# Altium schematic sheet MainBoard_144_IOs.SchDoc
size B
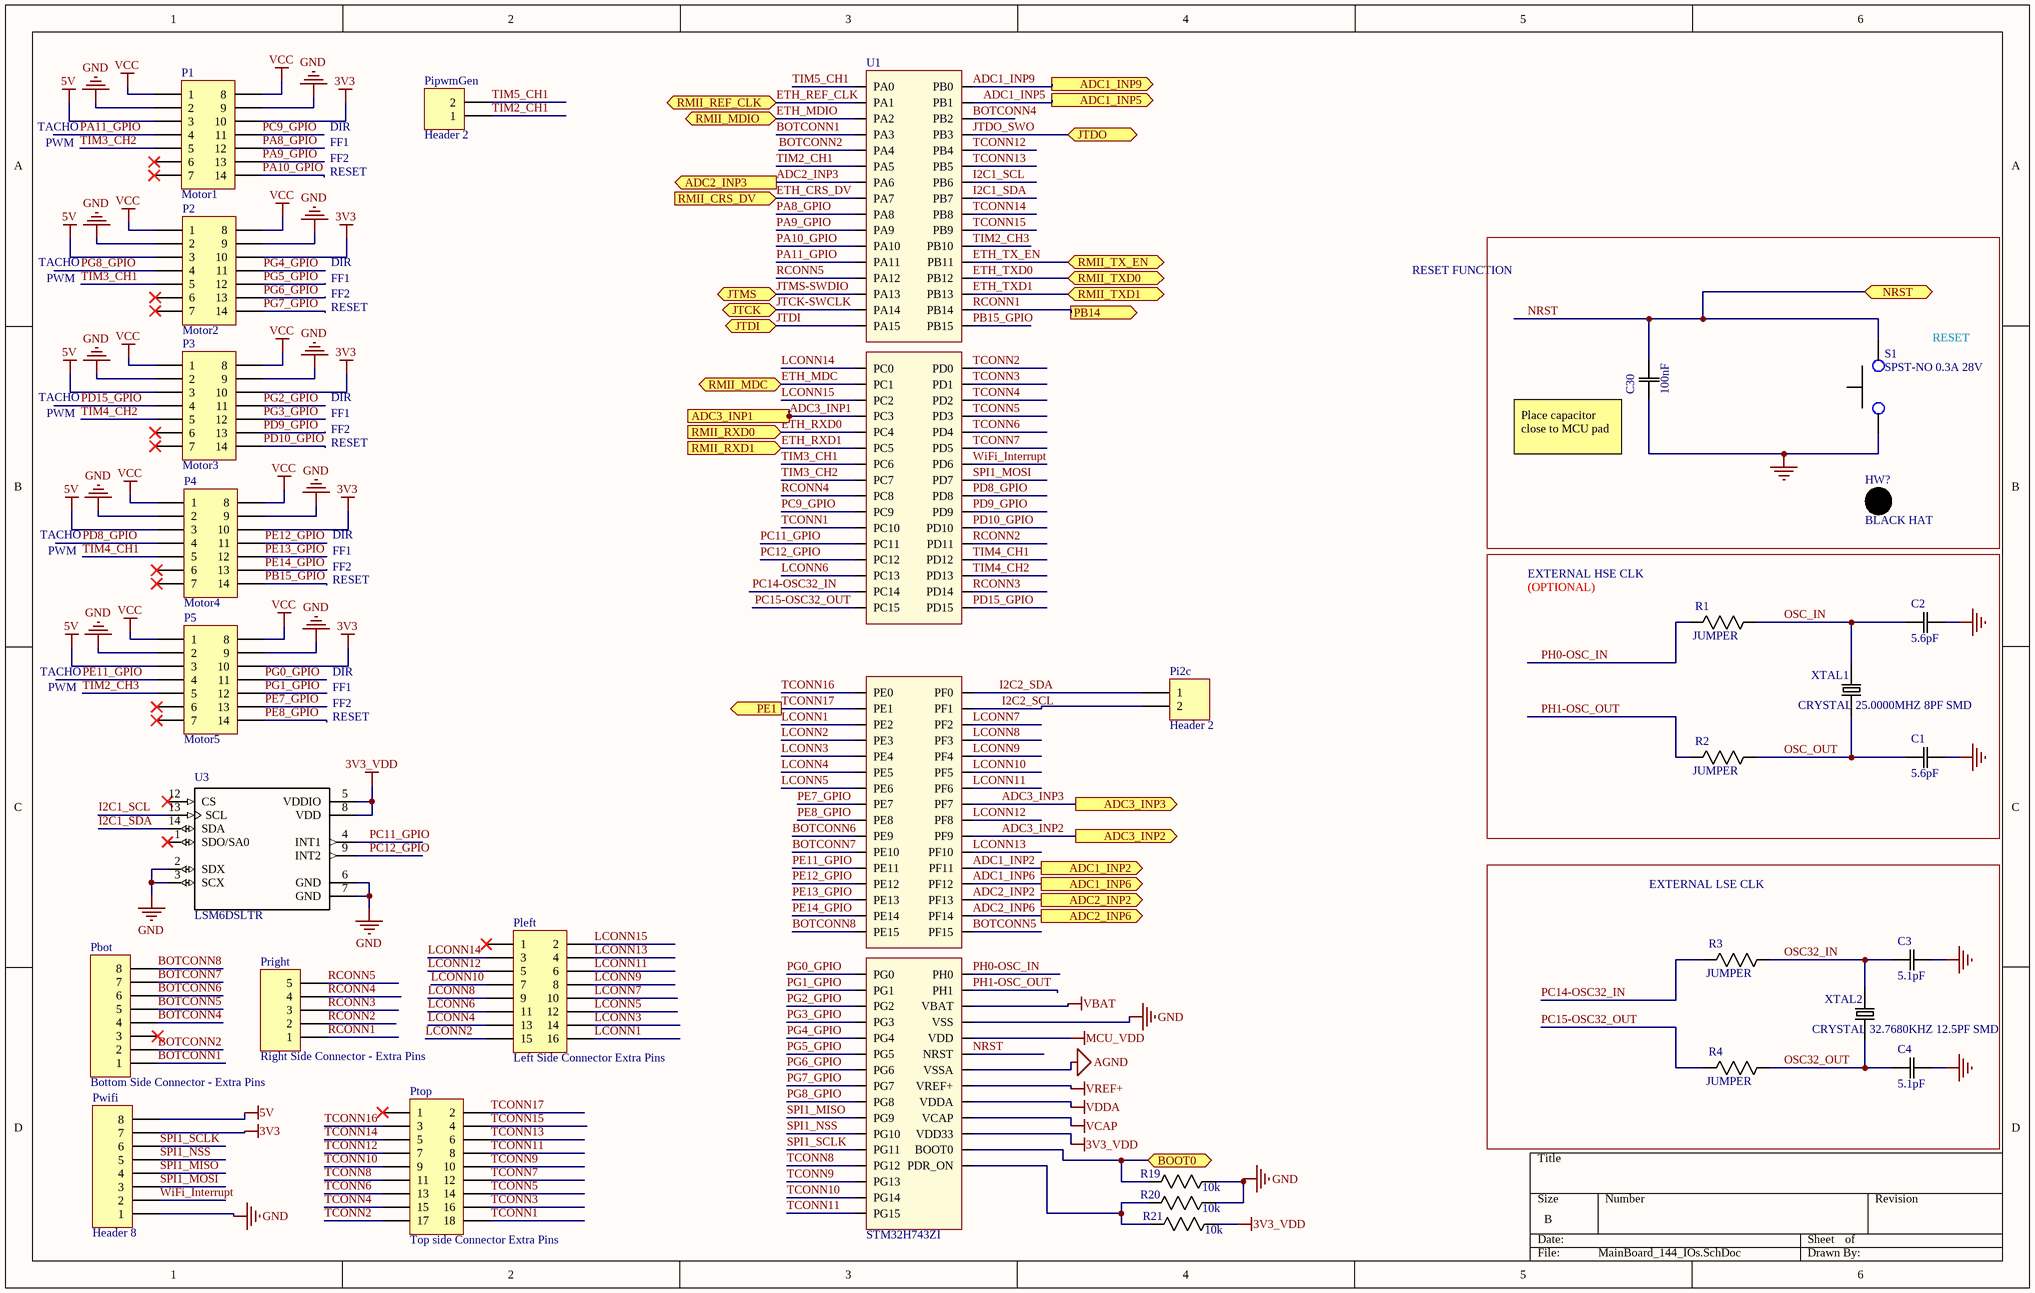
[diagram p0: MainBoard_144_IOs.SchDoc]

## Parts
C1  5.6pF  [0805]
C2  5.6pF  [0805]
C3  5.1pF  [0805]
C4  5.1pF  [0805]
C30  100nF  [0805]
HW?  value BLACK HAT  (hidden comment: BUTTON_HAT_BLACK)  (mechanical)
P1  Motor1  [HDR2X7_CEN]
P2  Motor2  [HDR2X7_CEN]
P3  Motor3  [HDR2X7_CEN]
P4  Motor4  [HDR2X7_CEN]
P5  Motor5  [HDR2X7_CEN]
Pbot  Bottom Side Connector - Extra Pins  [HDR1X8]
Pi2c  Header 2  [HDR1X2]
PipwmGen  Header 2  [HDR1X2]
Pleft  Left Side Connector Extra Pins  [HDR2X8]
Pright  Right Side Connector - Extra Pins  [HDR1X5]
Ptop  Top side Connector Extra Pins  [HDR2X9]
Pwifi  Header 8  [HDR1X8]
R1  JUMPER  [0805]
R2  JUMPER  [0805]
R3  JUMPER  [0805]
R4  JUMPER  [0805]
R19  10k  [0805]
R20  10k  [0805]
R21  10k  [0805]
S1  SPST-NO 0.3A 28V  [PB300STQ]
U1  STM32H743ZI  [STM32H7]
U3  LSM6DSLTR  [LGA-14]
XTAL1  CRYSTAL 25.0000MHZ 8PF SMD  [SMD-2]
XTAL2  CRYSTAL 32.7680KHZ 12.5PF SMD  [SMD-2]

## Blocks framed on the sheet
EXTERNAL LSE CLK: C3 C4 R3 R4 XTAL2

## Ports
ADC1_INP2 (out), ADC1_INP5 (out), ADC1_INP6 (out), ADC1_INP9 (out), ADC2_INP2 (out), ADC2_INP3 (out), ADC2_INP6 (out), ADC3_INP1 (out), ADC3_INP2 (out), ADC3_INP3 (out), BOOT0 (bidir), JTCK (bidir), JTDI (bidir), JTDO (bidir), JTMS (bidir), NRST (bidir), PB14 (out), PE1 (out), RMII_CRS_DV (in), RMII_MDC (bidir), RMII_MDIO (bidir), RMII_REF_CLK (bidir), RMII_RXD0 (in), RMII_RXD1 (in), RMII_TX_EN (bidir), RMII_TXD0 (bidir), RMII_TXD1 (bidir)

## Nets
3V3: P1.10 P2.10 P3.10 P4.10 P5.10 Pwifi.7
3V3_VDD: R21.1(R1) U1.VDD33USB(VDD33) U3.5(VDDIO) U3.8(VDD)
5V: P1.3 P2.3 P3.3 P4.3 P5.3 Pwifi.8
AGND: U1.VSSA
GND: C1.2(C2) C2.2(C2) C3.2(C2) C4.2(C2) C30.1(C1) P1.2 P1.9 P2.2 P2.9 P3.2 P3.9 P4.2 P4.9 P5.2 P5.9 Pwifi.1 R19.1(R1) R20.1(R1) S1.1 U1.VSS U3.2(SDX) U3.3(SCX) U3.6(GND) U3.7(GND)
MCU_VDD: U1.VDD
VBAT: U1.VBAT
VCAP: U1.VCAP
VCC: P1.1 P1.8 P2.1 P2.8 P3.1 P3.8 P4.1 P4.8 P5.1 P5.8
VDDA: U1.VDDA
VREF+: U1.VREF+
ADC1_INP2: U1.PF11 ; port ADC1_INP2
ADC1_INP5: U1.PB1 ; port ADC1_INP5
ADC1_INP6: U1.PF12 ; port ADC1_INP6
ADC1_INP9: U1.PB0 ; port ADC1_INP9
ADC2_INP2: U1.PF13 ; port ADC2_INP2
ADC2_INP3: U1.PA6 ; port ADC2_INP3
ADC2_INP6: U1.PF14 ; port ADC2_INP6
ADC3_INP1: U1.PC3 ; port ADC3_INP1
ADC3_INP2: U1.PF9 ; port ADC3_INP2
ADC3_INP3: U1.PF7 ; port ADC3_INP3
BOOT0: R19.2(R2) U1.BOOT0 ; port BOOT0
BOTCONN1: Pbot.1 U1.PA3
BOTCONN2: Pbot.2 U1.PA4
BOTCONN4: Pbot.4 U1.PB2
BOTCONN5: Pbot.5 U1.PF15
BOTCONN6: Pbot.6 U1.PE9
BOTCONN7: Pbot.7 U1.PE10
BOTCONN8: Pbot.8 U1.PE15
ETH_CRS_DV: U1.PA7 ; port RMII_CRS_DV
ETH_MDC: U1.PC1 ; port RMII_MDC
ETH_MDIO: U1.PA2 ; port RMII_MDIO
ETH_REF_CLK: U1.PA1 ; port RMII_REF_CLK
ETH_RXD0: U1.PC4 ; port RMII_RXD0
ETH_RXD1: U1.PC5 ; port RMII_RXD1
ETH_TX_EN: U1.PB11 ; port RMII_TX_EN
ETH_TXD0: U1.PB12 ; port RMII_TXD0
ETH_TXD1: U1.PB13 ; port RMII_TXD1
I2C1_SCL: U1.PB6 U3.13(SCL)
I2C1_SDA: U1.PB7 U3.14(SDA)
I2C2_SCL: Pi2c.2 U1.PF1
I2C2_SDA: Pi2c.1 U1.PF0
JTCK-SWCLK: U1.PA14 ; port JTCK
JTDI: U1.PA15 ; port JTDI
JTDO_SWO: U1.PB3 ; port JTDO
JTMS-SWDIO: U1.PA13 ; port JTMS
LCONN1: Pleft.16 U1.PE2
LCONN2: Pleft.15 U1.PE3
LCONN3: Pleft.14 U1.PE4
LCONN4: Pleft.13 U1.PE5
LCONN5: Pleft.12 U1.PE6
LCONN6: Pleft.11 U1.PC13
LCONN7: Pleft.10 U1.PF2
LCONN8: Pleft.9 U1.PF3
LCONN9: Pleft.8 U1.PF4
LCONN10: Pleft.7 U1.PF5
LCONN11: Pleft.6 U1.PF6
LCONN12: Pleft.5 U1.PF8
LCONN13: Pleft.4 U1.PF10
LCONN14: Pleft.3 U1.PC0
LCONN15: Pleft.2 U1.PC2
NRST: C30.2(C2) S1.2 U1.NRST ; port NRST
OSC32_IN: C3.1(C1) R3.1(R1) XTAL2.2
OSC32_OUT: C4.1(C1) R4.1(R1) XTAL2.1
OSC_IN: C2.1(C1) R1.1(R1) XTAL1.2
OSC_OUT: C1.1(C1) R2.1(R1) XTAL1.1
PA8_GPIO: P1.12 U1.PA8
PA9_GPIO: P1.13 U1.PA9
PA10_GPIO: P1.14 U1.PA10
PA11_GPIO: P1.4 U1.PA11
PB15_GPIO: P4.14 U1.PB15
PC9_GPIO: P1.11 U1.PC9
PC11_GPIO: U1.PC11 U3.4(INT1)
PC12_GPIO: U1.PC12 U3.9(INT2)
PC14-OSC32_IN: R3.2(R2) U1.PC14
PC15-OSC32_OUT: R4.2(R2) U1.PC15
PD8_GPIO: P4.4 U1.PD8
PD9_GPIO: P3.13 U1.PD9
PD10_GPIO: P3.14 U1.PD10
PD15_GPIO: P3.4 U1.PD15
PE7_GPIO: P5.13 U1.PE7
PE8_GPIO: P5.14 U1.PE8
PE11_GPIO: P5.4 U1.PE11
PE12_GPIO: P4.11 U1.PE12
PE13_GPIO: P4.12 U1.PE13
PE14_GPIO: P4.13 U1.PE14
PG0_GPIO: P5.11 U1.PG0
PG1_GPIO: P5.12 U1.PG1
PG2_GPIO: P3.11 U1.PG2
PG3_GPIO: P3.12 U1.PG3
PG4_GPIO: P2.11 U1.PG4
PG5_GPIO: P2.12 U1.PG5
PG6_GPIO: P2.13 U1.PG6
PG7_GPIO: P2.14 U1.PG7
PG8_GPIO: P2.4 U1.PG8
PH0-OSC_IN: R1.2(R2) U1.PH0
PH1-OSC_OUT: R2.2(R2) U1.PH1
RCONN1: Pright.1 U1.PB14 ; port PB14
RCONN2: Pright.2 U1.PD11
RCONN3: Pright.3 U1.PD14
RCONN4: Pright.4 U1.PC8
RCONN5: Pright.5 U1.PA12
SPI1_MISO: Pwifi.4 U1.PG9
SPI1_MOSI: Pwifi.3 U1.PD7
SPI1_NSS: Pwifi.5 U1.PG10
SPI1_SCLK: Pwifi.6 U1.PG11
TCONN1: Ptop.18 U1.PC10
TCONN2: Ptop.17 U1.PD0
TCONN3: Ptop.16 U1.PD1
TCONN4: Ptop.15 U1.PD2
TCONN5: Ptop.14 U1.PD3
TCONN6: Ptop.13 U1.PD4
TCONN7: Ptop.12 U1.PD5
TCONN8: Ptop.11 U1.PG12
TCONN9: Ptop.10 U1.PG13
TCONN10: Ptop.9 U1.PG14
TCONN11: Ptop.8 U1.PG15
TCONN12: Ptop.7 U1.PB4
TCONN13: Ptop.6 U1.PB5
TCONN14: Ptop.5 U1.PB8
TCONN15: Ptop.4 U1.PB9
TCONN16: Ptop.3 U1.PE0
TCONN17: Ptop.2 U1.PE1 ; port PE1
TIM2_CH1: PipwmGen.1 U1.PA5
TIM2_CH3: P5.5 U1.PB10
TIM3_CH1: P2.5 U1.PC6
TIM3_CH2: P1.5 U1.PC7
TIM4_CH1: P4.5 U1.PD12
TIM4_CH2: P3.5 U1.PD13
TIM5_CH1: PipwmGen.2 U1.PA0
WiFi_Interrupt: Pwifi.2 U1.PD6
NetR20_2: R20.2(R2) R21.2(R2) U1.PDR_ON

Not connected (* = marked no-connect by the designer): P1 6* 7*; P2 6* 7*; P3 6* 7*; P4 6* 7*; P5 6* 7*; Pbot 3*; Pleft 1*; Ptop 1*; U3 1(SDO/SA0)* 12(CS)*

## Notes on the sheet
- TACHO
- PWM
- DIR
- FF1
- FF2
- RESET
- RESET FUNCTION
- (near C30) Place capacitor close to MCU pad
- EXTERNAL HSE CLK
- (OPTIONAL)

## Library data of the parts
C1 C2 = CAP 5.6pF 0805: CAP CER 5.6PF 50V C0G/NP0 0805; MP: C0805C569D5GACTU; MF: KEMET; Tolerance: 5%; Package: 0805; Price: 0,249 CAD; Value: 5.6pF; Digikey: 399-9261-1-ND; Digikey Link: https://www.digikey.ca/product-detail/en/kemet/C0805C569D5GACTU/399-9261-1-ND/3522779; Rating: 50V
C3 C4 = CAP 5.1pF 0805: CAP CER 5.1PF 630V NP0 0805; MP: C0805C519KBGAC7800; MF: KEMET; Tolerance: 10%; Rating: 50V; Package: 0805; Price: 0,493 CAD; Value: 5.1pF; Digikey: 399-16524-1-ND; Digikey Link: https://www.digikey.ca/product-detail/en/kemet/C0805C519KBGAC7800/399-16524-1-ND/7917337
C30 = CAP 100nF 0805: CAP CER 0.1UF 50V X7R 0805; MP: CC0805KRX7R9BB104; MF: Yageo; Tolerance: 10%; Package: 0805; Price: 0,119 CAD; Value: 100nF; Digikey: 311-1140-1-ND; Digikey Link: https://www.digikey.ca/products/en?keywords=311-1140-1-ND; Rating: 50V
HW? = MCD-00635: Black Hat for switch TD0341X-G01-BLA; Part_Type: Mechanical; Manufacturer_Part_Number: 988.16.09.3.00003_SH-517; Manufacturer: JIUBABA; Provided_By: SUBCO; Internal_Part_Number: MCD-00635; Status: Released; ComponentLink1Description: Datasheet; ComponentLink1URL: http://tunmcdsvn.tun.st.com/Component_Datasheet_Library/Trunk/Mechanical/Jiubaba_HAT_SH-517; ECCN_US: n/a; ECCN_EU: n/a
P1-P5 = Header 7X2A: Header, 7-Pin, Dual row; LatestRevisionDate: 17-Jul-2002; LatestRevisionNote: Re-released for DXP Platform.; Publisher: Altium Limited
Pbot Pwifi = Header 8: Header, 8-Pin; LatestRevisionDate: 17-Jul-2002; LatestRevisionNote: Re-released for DXP Platform.; Publisher: Altium Limited
Pi2c PipwmGen = Header 2: Header, 2-Pin; LatestRevisionDate: 17-Jul-2002; LatestRevisionNote: Re-released for DXP Platform.; Publisher: Altium Limited
Pleft = Header 8X2: Header, 8-Pin, Dual row; LatestRevisionDate: 17-Jul-2002; LatestRevisionNote: Re-released for DXP Platform.; Publisher: Altium Limited
Pright = Header 5: Header, 5-Pin; LatestRevisionDate: 17-Jul-2002; LatestRevisionNote: Re-released for DXP Platform.; Publisher: Altium Limited
Ptop = Header 9X2: Header, 9-Pin, Dual row; LatestRevisionDate: 17-Jul-2002; LatestRevisionNote: Re-released for DXP Platform.; Publisher: Altium Limited
R1-R4 = RES 0 0805: RES SMD 0 OHM JUMPER 1/8W 0805; MP: RC0805JR-070RL; MF: Yageo; Value: 0; Rating: 0.125W; Digikey: 311-0.0ARCT-ND; Price: 0.058 CAD; Package: 0805; Digikey Link: https://www.digikey.ca/products/en?keywords=311-0.0ARCT-ND
R19-R21 = RES 10k 0805: RES SMD 10K OHM 1% 1/8W 0805; MP: RC0805FR-0710KL; MF: Yageo; Rating: 0.125W; Digikey: 311-10.0KCRCT-ND; Price: 0.061 CAD; Package: 0805; Value: 10k; Digikey Link: https://www.digikey.ca/products/en?keywords=311-10.0KCRCT-ND; Tolerance: 1%
S1 = SW PUSH NO: Pushbutton Switch SPST-NO Standard Through Hole; MF: E-Switch; Rating: 28V 0.3A; ComponentLink1Description: Digikey; ComponentLink1URL: https://www.digikey.ca/product-detail/en/e-switch/PB300STQ/EG5398-ND/6126493; ComponentLink2Description: Datasheet; ComponentLink2URL: https://sten-eswitch-13110800-production.s3.amazonaws.com/system/asset/product_line/data_sheet/222/PB300.pdf; Digikey: EG5398-ND; Digikey Link: https://www.digikey.ca/product-detail/en/e-switch/PB300STQ/EG5398-ND/6126493; MP: PB300STQ; Price: 3.40000 CAD
U1 = STM32H743ZI: MF: STMicroelectronics; MP: STM32H743ZIT6; Digikey: 497-17721-ND; Digikey Link: https://www.digikey.ca/product-detail/en/stmicroelectronics/STM32H743ZIT6/497-17721-ND/7809238; Package: 144-LQFP (20x20)
U3 = LSM6DSLTR: Accelerometer, Gyroscope, Temperature, 6 Axis Sensor IÂ²C, SPI Output; MF: STMicroelectronics; SnapEDA_Link: https://www.snapeda.com/parts/LSM6DSLTR/STMicroelectronics/view-part/550517/?ref=snap; Price: None; Availability: Unavailable; MP: LSM6DSLTR; Package: LGA-14 STMicroelectronics; Value: *
XTAL1 = XTAL 25MHZ 8PF SMD: 25MHz ±50ppm Crystal 8pF 70 Ohms 2-SMD, No Lead; MP: NX5032GA-25.000000MHZ-LN-CD-1; MF: NDK America, Inc.; ESR: 70 Ohms; Package: 2-SMD, No Lead; Price: 0.95 CAD; Frequency: 25MHz; Digikey: 644-1041-1-ND; Digikey Link: https://www.digikey.ca/product-detail/en/ndk-america-inc/NX5032GA-25.000000MHZ-LN-CD-1/644-1041-1-ND/1128913; Load Capacitance: 8pF
XTAL2 = XTAL 32.7680KHZ 12.5PF SMD: 32.768kHz ±20ppm Crystal 12.5pF 70 kOhms 2-SMD, No Lead; MP: NX3215SA-32.768K-STD-MUA-8; MF: NDK America, Inc.; Package: 2-SMD, No Lead; Price: 1.04000 CAD; Frequency: 32.768kHz; Digikey: 644-1156-1-ND; Digikey Link: https://www.digikey.ca/en/products/detail/ndk-america-inc/NX3215SA-32-768K-STD-MUA-8/2261469?s=N4IgTCBcDaIGwBYEFoCMqCsc3IHIBEQBdAXyA; Load Capacitance: 12.5pF; ESR: 70 kOhms; ComponentLink1Description: Digikey; ComponentLink1URL: https://www.digikey.ca/en/products/detail/ndk-america-inc/NX3215SA-32-768K-STD-MUA-8/2261469; ComponentLink2Description: Datasheet; ComponentLink2URL: https://media.digikey.com/datasheets/production/702868/1/NX3215SA-32-768K-STD-MUA-8.html